# Altium schematic sheet GPS_CAM-M8Q.SchDoc
size A4; SheetNumber: 4; SheetTotal: 10
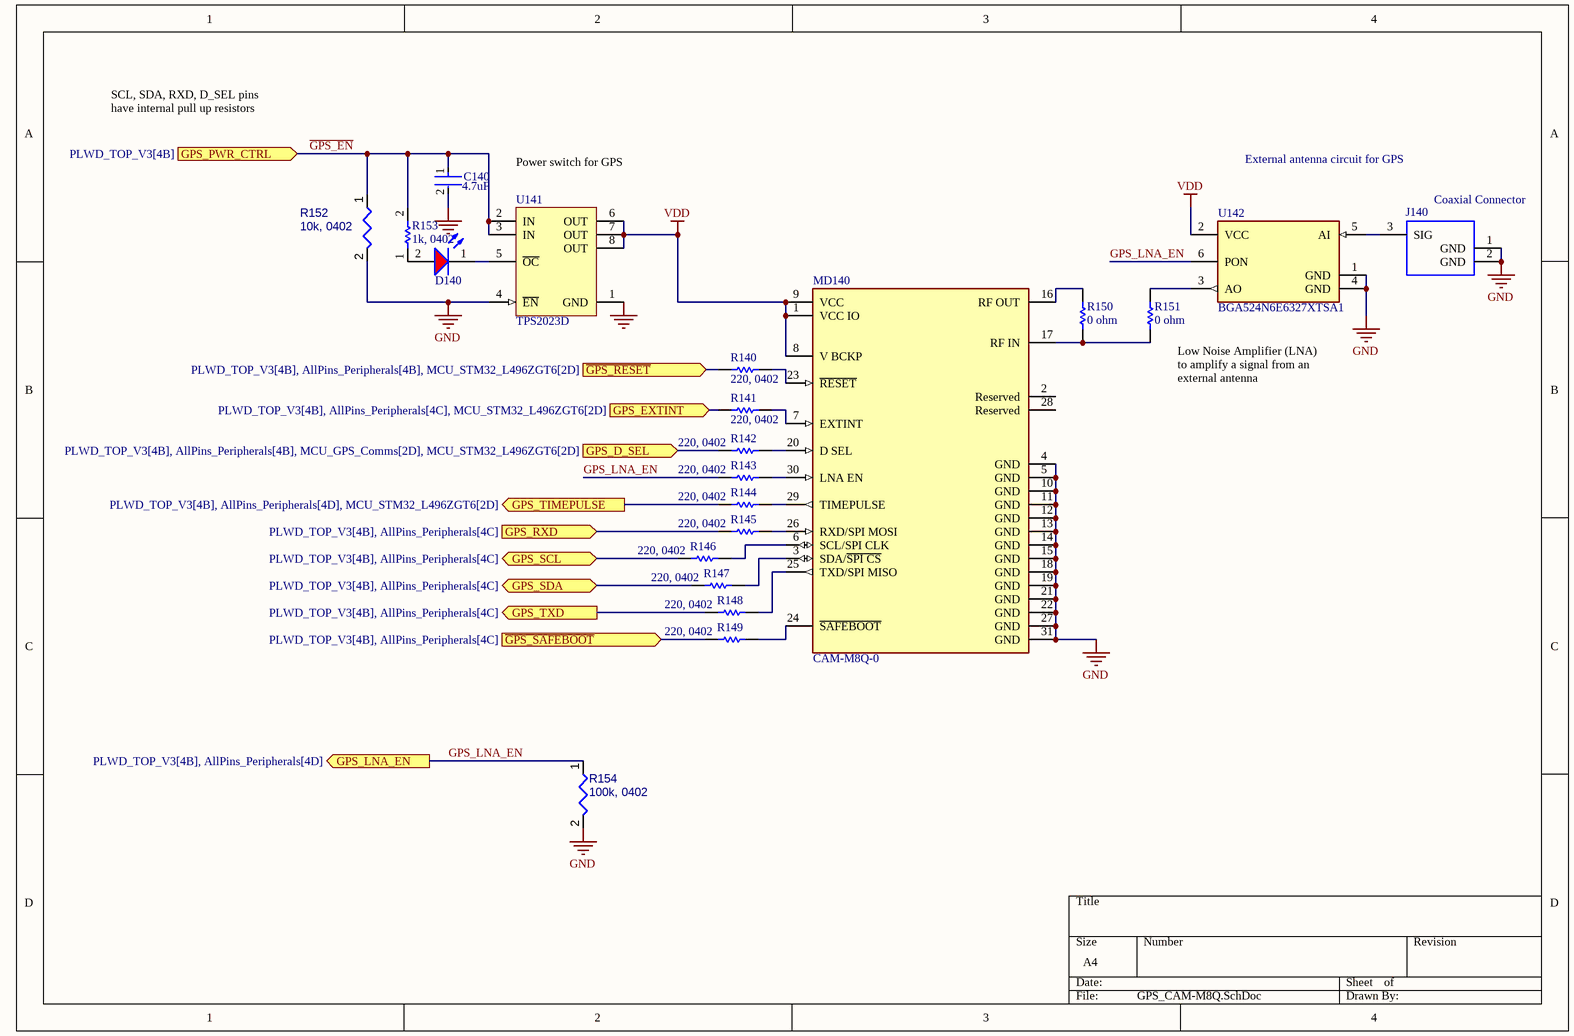
[diagram p0: GPS_CAM-M8Q.SchDoc]

## Parts
C140  Capacitance: 4.7uF  [FP-CL282-IPC_C]  (hidden comment: CL05A475MP5NRNC)
D140  150120SS75000  [WL-SMCW_1206_150120xx75000]  (value not drawn)
J140  Coaxial Connector  [HRS-U.FL-R-SMT_V]
MD140  CAM-M8Q-0  [FP-CAM-M8Q-0-MFG]
R140  220, 0402  [RESC1005X40X25LL10T10]
R141  220, 0402  [RESC1005X40X25LL10T10]
R142  220, 0402  [RESC1005X40X25LL10T10]
R143  220, 0402  [RESC1005X40X25LL10T10]
R144  220, 0402  [RESC1005X40X25LL10T10]
R145  220, 0402  [RESC1005X40X25LL10T10]
R146  220, 0402  [RESC1005X40X25LL10T10]
R147  220, 0402  [RESC1005X40X25LL10T10]
R148  220, 0402  [RESC1005X40X25LL10T10]
R149  220, 0402  [RESC1005X40X25LL10T10]
R150  0 ohm  [RESC1005X40X25LL05T10]
R151  0 ohm  [RESC1005X40X25LL05T10]
R152  10k, 0402  [RESC1005X40X25ML05T05]
R153  1k, 0402  [RESC1005X40X25ML05T05]
R154  100k, 0402  [RESC1005X40X25ML05T05]
U141  TPS2023D  [D0008A_M]
U142  BGA524N6E6327XTSA1  [FP-PG-TSNP-6-MFG]

## Ports
GPS_D_SEL (in, see PLWD_TOP_V3[4B], AllPins_Peripherals[4B], MCU_GPS_Comms[2D], MCU_STM32_L496ZGT6[2D]), GPS_EXTINT (in, see PLWD_TOP_V3[4B], AllPins_Peripherals[4C], MCU_STM32_L496ZGT6[2D]), GPS_LNA_EN (out, see PLWD_TOP_V3[4B], AllPins_Peripherals[4D]), GPS_PWR_CTRL (in, see PLWD_TOP_V3[4B]), GPS_RXD (in, see PLWD_TOP_V3[4B], AllPins_Peripherals[4C]), GPS_SCL (bidir, see PLWD_TOP_V3[4B], AllPins_Peripherals[4C]), GPS_SDA (bidir, see PLWD_TOP_V3[4B], AllPins_Peripherals[4C]), GPS_TIMEPULSE (out, see PLWD_TOP_V3[4B], AllPins_Peripherals[4D], MCU_STM32_L496ZGT6[2D]), GPS_TXD (out, see PLWD_TOP_V3[4B], AllPins_Peripherals[4C]), ~{GPS_RESET} (in, see PLWD_TOP_V3[4B], AllPins_Peripherals[4B], MCU_STM32_L496ZGT6[2D]), ~{GPS_SAFEBOOT} (in, see PLWD_TOP_V3[4B], AllPins_Peripherals[4C])

## Nets
GND: C140.2 J140.1(GND) J140.2(GND) MD140.4(GND) MD140.5(GND) MD140.10(GND) MD140.11(GND) MD140.12(GND) MD140.13(GND) MD140.14(GND) MD140.15(GND) MD140.18(GND) MD140.19(GND) MD140.21(GND) MD140.22(GND) MD140.27(GND) MD140.31(GND) R152.2 R154.2 U141.1(GND) U141.4(~{EN}) U142.1(GND) U142.4(GND)
VDD: MD140.1(VCC_IO) MD140.8(V_BCKP) MD140.9(VCC) U141.6(OUT) U141.7(OUT) U141.8(OUT) U142.2(VCC)
~{GPS_EN}: C140.1 R152.1 R153.2 U141.2(IN) U141.3(IN) ; port GPS_PWR_CTRL
~{GPS_RESET}: R140.2 ; port ~{GPS_RESET}
~{GPS_SAFEBOOT}: R149.2 ; port ~{GPS_SAFEBOOT}
GPS_D_SEL: R142.2 ; port GPS_D_SEL
GPS_EXTINT: R141.2 ; port GPS_EXTINT
GPS_LNA_EN: R143.2 R154.1 U142.6(PON) ; port GPS_LNA_EN
GPS_RXD: R145.2 ; port GPS_RXD
GPS_SCL: R146.2 ; port GPS_SCL
GPS_SDA: R147.2 ; port GPS_SDA
GPS_TIMEPULSE: R144.2 ; port GPS_TIMEPULSE
GPS_TXD: R148.2 ; port GPS_TXD
NetD140_1: D140.1(K) U141.5(~{OC})
NetD140_2: D140.2(A) R153.1
NetJ140_3: J140.3(SIG) U142.5(AI)
NetMD140_3: MD140.3(SDA/~{SPI_CS}) R147.1
NetMD140_6: MD140.6(SCL/SPI_CLK) R146.1
NetMD140_7: MD140.7(EXTINT) R141.1
NetMD140_16: MD140.16(RF_OUT) R150.2
NetMD140_17: MD140.17(RF_IN) R150.1 R151.1
NetMD140_20: MD140.20(D_SEL) R142.1
NetMD140_23: MD140.23(~{RESET}) R140.1
NetMD140_24: MD140.24(~{SAFEBOOT}) R149.1
NetMD140_25: MD140.25(TXD/SPI_MISO) R148.1
NetMD140_26: MD140.26(RXD/SPI_MOSI) R145.1
NetMD140_29: MD140.29(TIMEPULSE) R144.1
NetMD140_30: MD140.30(LNA_EN) R143.1
NetR151_2: R151.2 U142.3(AO)

Not connected (* = marked no-connect by the designer): MD140 2(Reserved) 28(Reserved)

## Notes on the sheet
- SCL, SDA, RXD, D_SEL pins have internal pull up resistors
- (near U141) Power switch for GPS
- External antenna circuit for GPS
- (near R151) Low Noise Amplifier (LNA) to amplify a signal from an external antenna

## Library data of the parts
C140 = CMP-13271-000548-1: Cap Ceramic 4.7uF 10V X5R ±20% SMD 0402 +85°C Paper T/R; Max Operating Temperature: 85°C; Lead Free: Lead Free; Tolerance: 20%; Voltage Rating: 10V; Dielectric: X5R; Width: 0.02inch; Length: 0.039inch; Case/Package: 0402; Min Operating Temperature: -55°C; Packaging: Tape and Reel; Thickness: 0.022inch; Case Code (Imperial): 0402; Package Quantity: 10000; Case Code (Metric): 1005; Mount: Surface Mount
D140 = CMP-1426-00017-2: NexarPartId: 29717789; Luminous Intensity: 60mcd; Viewing Angle: 140°; Test Current: 20mA; Lens Style: Clear, Rectangular; Wavelength: 630nm; Max Reverse Voltage (DC): 5V; Color: Red; Forward Current: 100mA; Peak Wavelength: 645nm; Forward Voltage: 1.9V; Case Code (Imperial): 1206; Mount: Surface Mount; Height: 680µm; RoHS: Compliant; REACH SVHC: Unknown; Case Code (Metric): 3216; Width: 1.6mm; Dominant Wavelength: 630nm; Packaging: Tape and Reel; Min Operating Temperature: -40°C; Max Operating Temperature: 85°C; Case/Package: 1206; Length: 3.2mm
J140 = CMP-002-00035-2: Ultra Small Surface Mount Coaxial Connector, 50 Ohm, -40 to 90 degC, 3-Pin SMD, RoHS, Tape and Reel; Manufacturer: Hirose Electric; Impedance: 50Ohm; Connector Type: RF&Coax; Max Operating Temperature: 90°C; Contact Material: Brass; Packaging: TapeandReel; Mounting Technology: SM; Package Quantity: 2500; Min Operating Temperature: -40°C; Contact Plating: Gold; RoHS Compliant: True; Datasheet Version: Aug-16; Package Description: 3-Pin Surface Mount Device, Body 2.6 x 2.6 mm; Datasheet URL: https://www.hirose.com/product/en/download_file/key_name/U.FL/category/Catalog/doc_file_id/31697/?file_category_id=4&item_id=15&is_series=1; Package Reference: U.FL-R-SMT; Fastening Type: Snap; Resistance: 50Ohm; Manufacturer URL: https://www.hirose.com; Case/Package: U.FL-R-SMT
MD140 = CMP-207130-000001-1: RF RCVR GNSS/GPS 1.575GHZ MODULE; Manufacturer: u-blox; Data Rate: 400kbits/s; Max Frequency: 1602MHz; Min Supply Voltage: 1.4V; Nominal Supply Current: 10.4-30mA; Sensitivity: -138dBm; Interface: I2C,SPI,UART; Max Supply Voltage: 3.6V; Automotive Grade: NA; Octopart: https://octopart.com/cam-m8q-0-u-blox-54356730; Automotive: No; Package: CAM-M8Q-0; Device Class L1: Integrated Circuits (ICs); RoHS: TRUE; Footprint Url: https://www.u-blox.com/sites/default/files/CAM-M8-FW3_HardwareIntegrationManual_%28UBX-15030063%29.pdf; Height: 2.3mm; Device Class L3: RF Receivers; Temperature Range Low: -40°C; Manufacturer Part Number: CAM-M8Q-0; Device Class L2: RF Semiconductors and Devices; Temperature Range High: +85°C; ComponentLink2Description: Datasheet; Digikey Description: RF RCVR GNSS/GPS 1.575GHZ MODULE; ComponentLink2URL: https://www.u-blox.com/sites/default/files/CAM-M8-FW3_DataSheet_%28UBX-15031574%29.pdf; Category: UNK; Temperature: -40°C to +85°C; Lead Free: Yes
R140-R149 = CMP-2002-03891-1: Part Number: RK73H1ETTP2200F; Manufacturer: KOA Speer
R150 R151 = CMP-2002-06455-1: Manufacturer: Panasonic; Part Number: ERJ-S020R00X
R152 = CMP-009-00015-5: Chip Resistor, 10 KOhm, +/- 1%, 0.1 W, -55 to 155 degC, 0402 (1005 Metric); Voltage Rating: 50V; Power: 100mW; Case/Package: 0402; Value: 10k; RoHS Compliant: True; Min Operating Temperature: -55°C; Mounting Technology: SM; Tolerance: 1%; Max Operating Temperature: 155°C; Pins: 2
R153 = CMP-009-00009-5: Chip Resistor, 1 KOhm, +/- 1%, 0.1 W, -55 to 155 degC, 0402 (1005 Metric); Power: 100mW; Voltage Rating: 50V; Min Operating Temperature: -55°C; Max Operating Temperature: 155°C; RoHS Compliant: True; Mounting Technology: SM; Pins: 2; Tolerance: 1%; Case/Package: 0402; Value: 1k
R154 = CMP-009-00022-5: Chip Resistor, 100 KOhm, +/- 1%, 0.1 W, -55 to 155 degC, 0402 (1005 Metric); Power: 100mW; Voltage Rating: 50V; Mounting Technology: SM; Pins: 2; Value: 100k; Min Operating Temperature: -55°C; Tolerance: 1%; RoHS Compliant: True; Case/Package: 0402; Max Operating Temperature: 155°C
U141 = CMP-0337-00189-2: 1.65 A, 2.7 to 5.5 V Single Power Distribution Switch IC Hi-Side MOSFET, Fault Report, 33 mOhms rDS(On), -40 to 85 degC, 8-pin SOIC (D), Green (RoHS & no Sb/Br); Manufacturer: Texas Instruments; Continuous Current(Max)(A): 1.5; Enable: Active Low; Number of Switches: 1; Current Limit(A): 2.2; Vin(Max)(V): 5.5; Vin(Min)(V): 2.7; rDS(on) per FET(Typ)(mOhms): 33; Rating: Catalog; Eco-Plan: Green (RoHS & no Sb/Br); PartNumber: TPS2023D; PackageVersion: revM, Jun-2011; ComponentLink1URL: http://www.ti.com/general/docs/lit/getliterature.tsp?genericPartNumber=TPS2023&fileType=pdf; Code_JEDEC: MS-012AA; DatasheetVersion: SLVS175C; ComponentLink1Description: Datasheet; Mounting Technology: Surface Mount; PackageDescription: 8-Pin Plastic Small Outline Integrated Circuit, 4.9 x 3.9 mm, Pitch 1.27 mm Pitch; PackageReference: D0008A
U142 = CMP-32860-000011-1: IC AMP GPS 1.55-1.615GHZ TSNP6-2; P1dB: -16dBm; Gain: 19.6dB; Operating Supply Current: 2.5mA; Noise Figure: 0.55dB; Number of Channels: 1; Mount: Surface Mount; Frequency: 1.615GHz; Number of Pins: 6; Lead Free: Lead Free; Packaging: Cut Tape; Package Quantity: 15000; Series: -; Halogen Free: Halogen Free; RoHS Compliant: Yes; Test Frequency: 1.615GHz